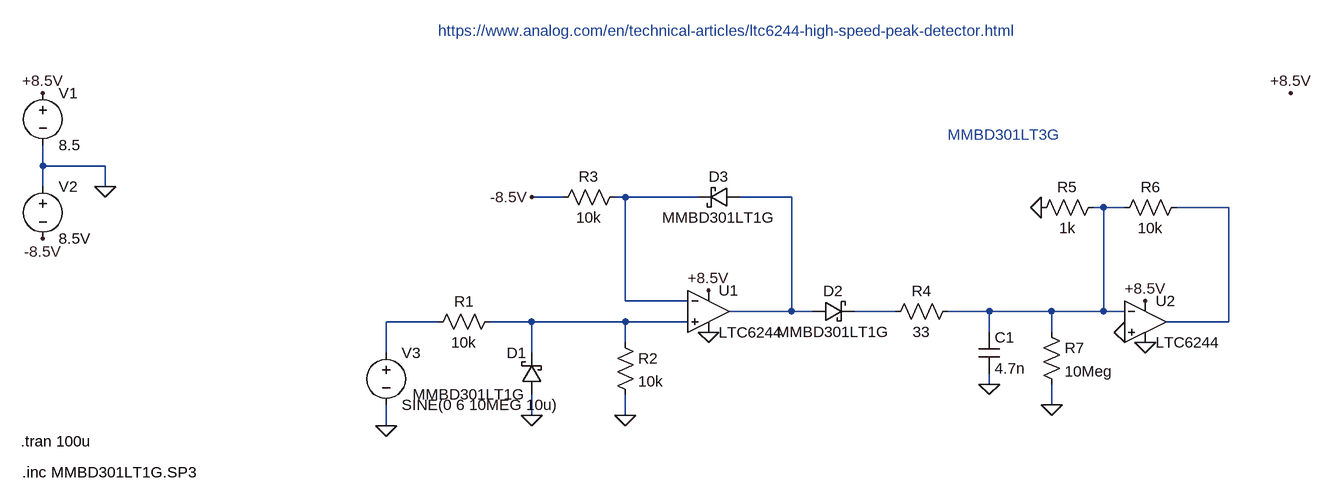
[diagram p0: schematic peak_detector.asc]
peak_detector.asc, the LTspice schematic file:
Version 4
SHEET 1 1484 728
WIRE -512 240 -512 208
WIRE -416 240 -512 240
WIRE -512 272 -512 240
WIRE -416 272 -416 240
WIRE 288 288 240 288
WIRE 384 288 368 288
WIRE 496 288 384 288
WIRE 640 288 560 288
WIRE 1120 304 1104 304
WIRE 1152 304 1120 304
WIRE 1312 304 1232 304
WIRE 384 448 384 288
WIRE 480 448 384 448
WIRE 640 464 640 288
WIRE 640 464 544 464
WIRE 672 464 640 464
WIRE 800 464 736 464
WIRE 944 464 880 464
WIRE 1040 464 944 464
WIRE 1120 464 1120 304
WIRE 1120 464 1040 464
WIRE 1152 464 1120 464
WIRE 96 480 16 480
WIRE 240 480 176 480
WIRE 384 480 240 480
WIRE 480 480 384 480
WIRE 1312 480 1312 304
WIRE 1312 480 1216 480
WIRE 944 496 944 464
WIRE 1040 496 1040 464
WIRE 384 512 384 480
WIRE 16 528 16 480
WIRE 240 528 240 480
WIRE 944 576 944 560
WIRE 1040 608 1040 576
WIRE 240 624 240 592
WIRE 384 624 384 592
WIRE 16 640 16 608
FLAG 240 624 0
FLAG 384 624 0
FLAG -416 272 0
FLAG -512 128 +8.5V
FLAG 512 432 +8.5V
FLAG 1408 128 +8.5V
FLAG -512 352 -8.5V
FLAG 240 288 -8.5V
FLAG 512 496 0
FLAG 1184 448 +8.5V
FLAG 1184 512 0
FLAG 944 576 0
FLAG 1024 304 0
FLAG 1152 496 0
FLAG 16 640 0
FLAG 1040 608 0
SYMBOL schottky 256 592 R180
WINDOW 0 24 64 Left 2
WINDOW 3 24 0 Left 2
SYMATTR InstName D1
SYMATTR Value MMBD301LT1G
SYMATTR Description Diode
SYMATTR Type diode
SYMBOL res 192 464 R90
WINDOW 0 0 56 VBottom 2
WINDOW 3 32 56 VTop 2
SYMATTR InstName R1
SYMATTR Value 10k
SYMBOL res 368 496 R0
SYMATTR InstName R2
SYMATTR Value 10k
SYMBOL Opamps\\LTC6244 512 464 R0
SYMATTR InstName U1
SYMBOL res 384 272 R90
WINDOW 0 0 56 VBottom 2
WINDOW 3 32 56 VTop 2
SYMATTR InstName R3
SYMATTR Value 10k
SYMBOL voltage -512 112 R0
WINDOW 123 0 0 Left 0
WINDOW 39 0 0 Left 0
SYMATTR InstName V1
SYMATTR Value 8.5
SYMBOL voltage -512 256 R0
WINDOW 123 0 0 Left 0
WINDOW 39 0 0 Left 0
SYMATTR InstName V2
SYMATTR Value 8.5V
SYMBOL schottky 560 272 R90
WINDOW 0 0 32 VBottom 2
WINDOW 3 32 32 VTop 2
SYMATTR InstName D3
SYMATTR Value MMBD301LT1G
SYMATTR Description Diode
SYMATTR Type diode
SYMBOL Opamps\\LTC6244 1184 480 R0
SYMATTR InstName U2
SYMBOL schottky 672 480 R270
WINDOW 0 32 32 VTop 2
WINDOW 3 0 32 VBottom 2
SYMATTR InstName D2
SYMATTR Value MMBD301LT1G
SYMATTR Description Diode
SYMATTR Type diode
SYMBOL res 896 448 R90
WINDOW 0 0 56 VBottom 2
WINDOW 3 32 56 VTop 2
SYMATTR InstName R4
SYMATTR Value 33
SYMBOL cap 928 496 R0
SYMATTR InstName C1
SYMATTR Value 4.7n
SYMBOL res 1120 288 R90
WINDOW 0 0 56 VBottom 2
WINDOW 3 32 56 VTop 2
SYMATTR InstName R5
SYMATTR Value 1k
SYMBOL res 1248 288 R90
WINDOW 0 0 56 VBottom 2
WINDOW 3 32 56 VTop 2
SYMATTR InstName R6
SYMATTR Value 10k
SYMBOL voltage 16 512 R0
WINDOW 123 0 0 Left 0
WINDOW 39 0 0 Left 0
SYMATTR InstName V3
SYMATTR Value SINE(0 6 10MEG 10u)
SYMBOL res 1024 480 R0
SYMATTR InstName R7
SYMATTR Value 10Meg
TEXT 96 32 Left 2 ;https://www.analog.com/en/technical-articles/ltc6244-high-speed-peak-detector.html
TEXT -546 664 Left 2 !.tran 100u
TEXT 880 192 Left 2 ;MMBD301LT3G
TEXT -544 712 Left 2 !.inc MMBD301LT1G.SP3

The netlist it stands for:
* peak_detector.asc
D1 0 N007 MMBD301LT1G
R1 N007 N006 10k
R2 N007 0 10k
XU1 N007 N001 +8.5V 0 N002 LTC6244  ; pins In+ In- V+ V- OUT
R3 N001 -8.5V 10k
V1 +8.5V 0 8.5
V2 0 -8.5V 8.5V
D3 N002 N001 MMBD301LT1G
XU2 0 N003 +8.5V 0 N004 LTC6244  ; pins In+ In- V+ V- OUT
D2 N002 N005 MMBD301LT1G
R4 N003 N005 33
C1 N003 0 4.7n
R5 N003 0 1k
R6 N004 N003 10k
V3 N006 0 SINE(0 6 10MEG 10u)
R7 N003 0 10Meg
.model D D
.lib standard.dio
* https://www.analog.com/en/technical-articles/ltc6244-high-speed-peak-detector.html
.tran 100u
* MMBD301LT3G
.inc MMBD301LT1G.SP3
.backanno
.end